# EAGLE design tick-mk-5.0 (EAGLE 6.5.0)
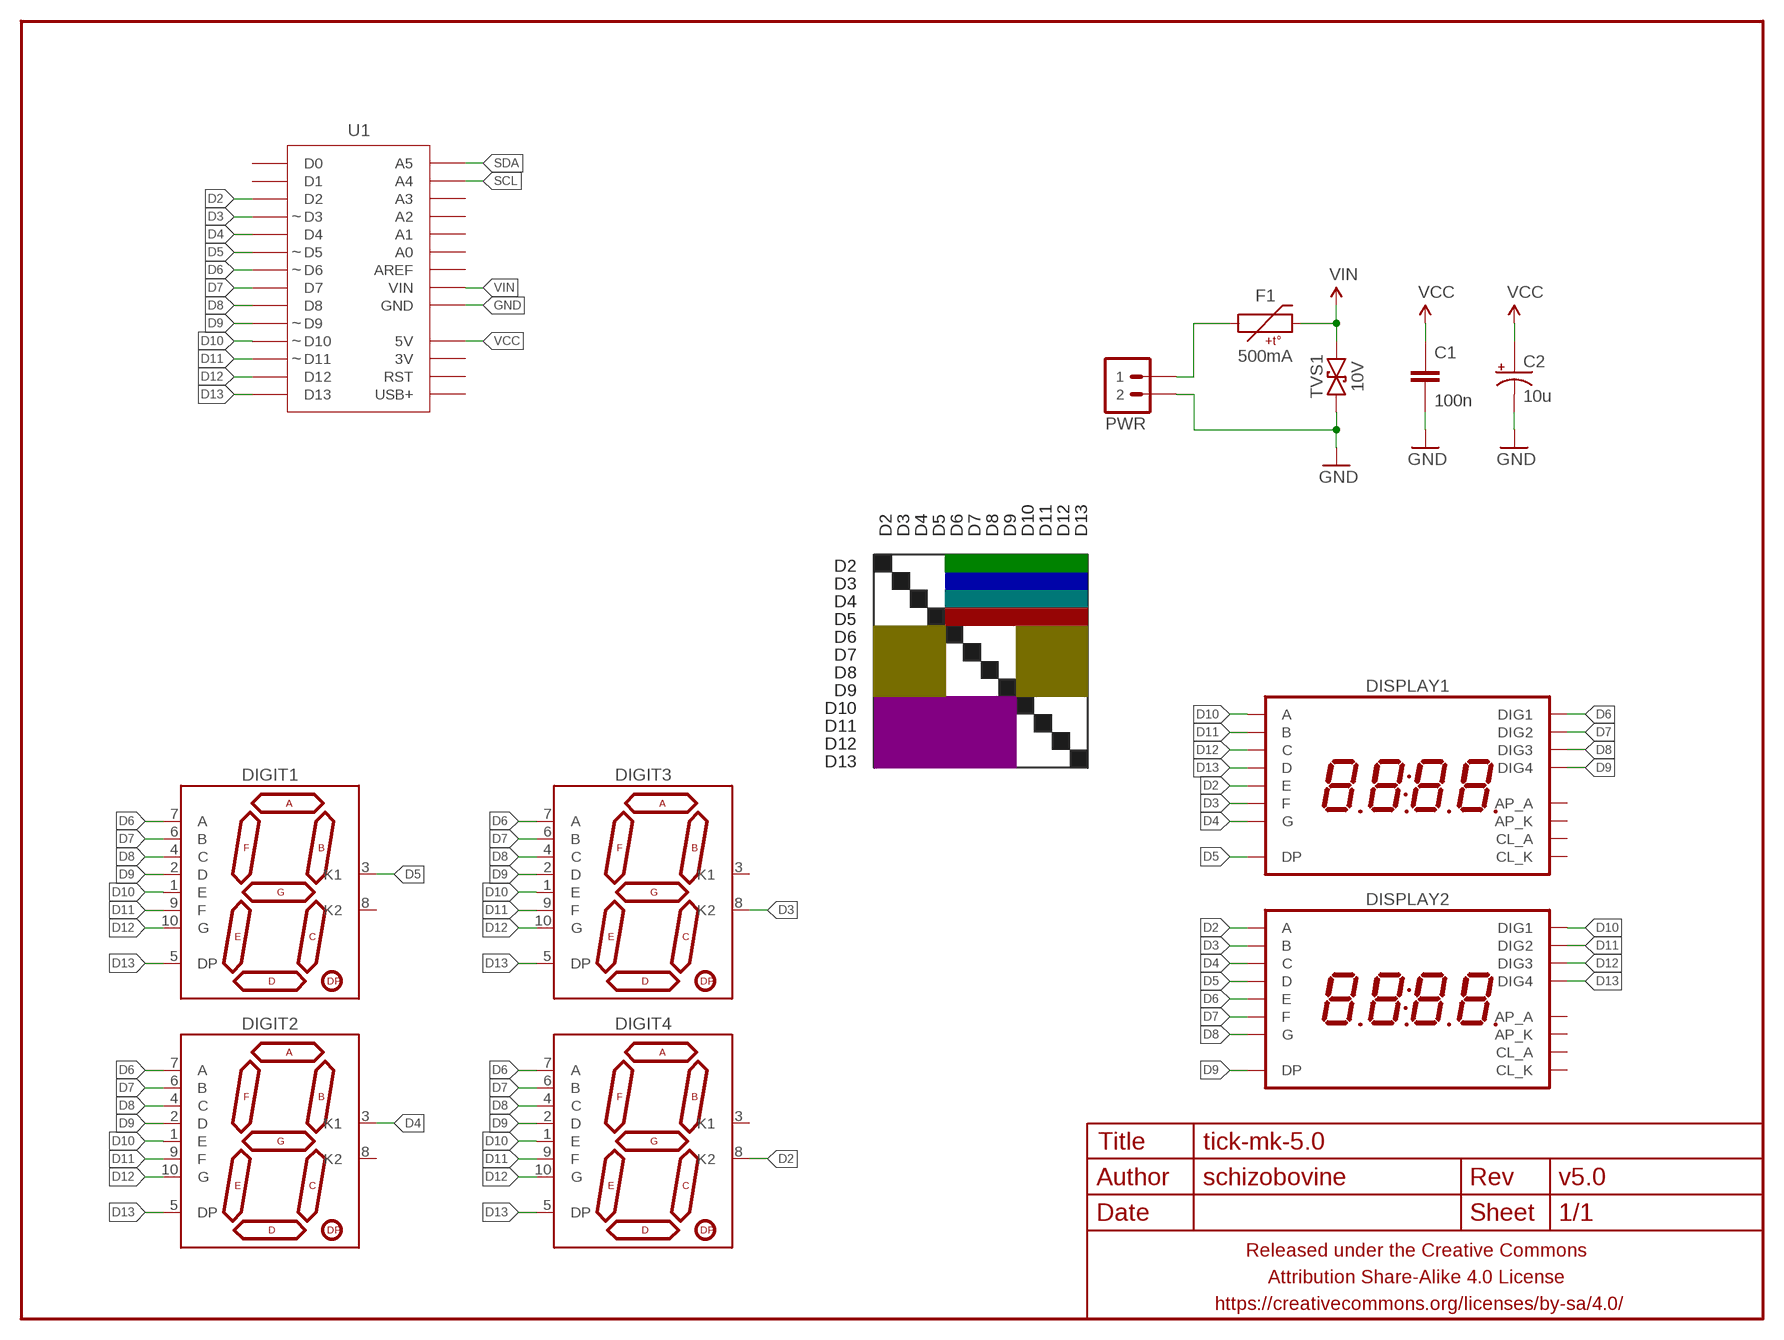
[diagram p0: schematic, sheet 1]

## Parts
C1  100n  CAPACITOR-CERAMIC025-024X044  [C025-024X044]
C2  10u  CAPACITOR-POLARIZEDE2-5  [E2-5]
DIGIT1  7SEG_1DIGPTH-25.4MM-BARE  [7SEG_1DIG_25.4MM_NOSILK]
DIGIT2  7SEG_1DIGPTH-25.4MM-BARE  [7SEG_1DIG_25.4MM_NOSILK]
DIGIT3  7SEG_1DIGPTH-25.4MM-BARE  [7SEG_1DIG_25.4MM_NOSILK]
DIGIT4  7SEG_1DIGPTH-25.4MM-BARE  [7SEG_1DIG_25.4MM_NOSILK]
DISPLAY1  7SEG_4DIGIT_COLON_APOS  [7SEG_4DIG_10MM]
DISPLAY2  7SEG_4DIGIT_COLON_APOS  [7SEG_4DIG_10MM]
F1  500mA  PTCPTH-5.08MM  [PTC-PTH-5.08MM]
FRAME1  FRAME-LETTERNO_PACKAGE  [DUMMY]
PWR  M02JST-PTH-VERT  [JST-2-PH-VERT-PTH]
TVS1  10V  TVSDO-41-10.16MM  [DO-41-TVS-BI-10.16MM]
U1  ADAFRUIT_METRO_MININOHOLES-NOOUTLINE-SILK  [ADAFRUIT_METRO_MINI]

## Nets
D2: DIGIT4.8(K2) DISPLAY1.5(E) DISPLAY2.14(A) U1.3(D2)
D3: DIGIT3.8(K2) DISPLAY1.11(F) DISPLAY2.16(B) U1.4(D3)
D4: DIGIT2.3(K1) DISPLAY1.15(G) DISPLAY2.13(C) U1.5(D4)
D5: DIGIT1.3(K1) DISPLAY1.7(DP) DISPLAY2.3(D) U1.6(D5)
D6: DIGIT1.7(A) DIGIT2.7(A) DIGIT3.7(A) DIGIT4.7(A) DISPLAY1.1(DIG1) DISPLAY2.5(E) U1.7(D6)
D7: DIGIT1.6(B) DIGIT2.6(B) DIGIT3.6(B) DIGIT4.6(B) DISPLAY1.2(DIG2) DISPLAY2.11(F) U1.8(D7)
D8: DIGIT1.4(C) DIGIT2.4(C) DIGIT3.4(C) DIGIT4.4(C) DISPLAY1.6(DIG3) DISPLAY2.15(G) U1.9(D8)
D9: DIGIT1.2(D) DIGIT2.2(D) DIGIT3.2(D) DIGIT4.2(D) DISPLAY1.8(DIG4) DISPLAY2.7(DP) U1.10(D9)
D10: DIGIT1.1(E) DIGIT2.1(E) DIGIT3.1(E) DIGIT4.1(E) DISPLAY1.14(A) DISPLAY2.1(DIG1) U1.11(D10)
D11: DIGIT1.9(F) DIGIT2.9(F) DIGIT3.9(F) DIGIT4.9(F) DISPLAY1.16(B) DISPLAY2.2(DIG2) U1.12(D11)
D12: DIGIT1.10(G) DIGIT2.10(G) DIGIT3.10(G) DIGIT4.10(G) DISPLAY1.13(C) DISPLAY2.6(DIG3) U1.13(D12)
D13: DIGIT1.5(DP) DIGIT2.5(DP) DIGIT3.5(DP) DIGIT4.5(DP) DISPLAY1.3(D) DISPLAY2.8(DIG4) U1.14(D13)
GND: C1.2 C2.- PWR.2 TVS1.P$1 U1.19(GND) U1.20(GND)
N$7: F1.P$1 PWR.1
SCL: U1.27(A4)
SDA: U1.28(A5)
VCC: C1.1 C2.+ U1.18(5V)
VIN: F1.P$2 TVS1.P$2 U1.21(VIN)
Unconnected: DIGIT1.8(K2) DIGIT2.8(K2) DIGIT3.3(K1) DIGIT4.3(K1) DISPLAY1.4(CL_A) DISPLAY1.9(AP_K) DISPLAY1.10(AP_A) DISPLAY1.12(CL_K) DISPLAY2.4(CL_A) DISPLAY2.9(AP_K) DISPLAY2.10(AP_A) DISPLAY2.12(CL_K) U1.1(D0) U1.2(D1) U1.15(USB+) U1.16(RST) U1.17(3V) U1.22(AREF) U1.23(A0) U1.24(A1) U1.25(A2) U1.26(A3)

## Notes on the sheet
- D2 | D3 | D4 | D5 | D6 | D7 | D8 | D9 | D10 | D11 | D12 | D13
- D2
- D3
- D4
- D5
- D6
- D7
- D8
- D9
- D10
- D11
- D12
- D13

## Library data of the parts
C1 = A_butts:CAPACITOR-CERAMIC: CAPACITOR, European symbol
C2 = A_butts:CAPACITOR-POLARIZED: POLARIZED CAPACITOR, American symbol
DIGIT1-DIGIT4 = A_butts:7SEG_1DIG
DISPLAY1 DISPLAY2 = A_butts:7SEG_4DIGIT_COLON_APOS
F1 = A_butts:PTC: Resettable Fuse PTC Resettable Fuse. Spark Fun Electronics SKU : COM-08357
FRAME1 = A_butts:FRAME-LETTER: Schematic Frame Standard 8.5x11 US Letter frame; DESIGNER: schizobovine; VERSION: v5.0
PWR = A_butts:M02: Standard 2-pin 0.1" header. Use with - straight break away headers ( PRT-00116) - right angle break away headers (PRT-00553) - swiss pins (PRT-00743) - machine pins (PRT-00117) - female headers (PRT-00115) Molex polarized connector foot print use with: PRT-08233 with associated crimp pins and housings. 2.54_SCREWTERM for use with PRT-10571. 3.5mm Screw Terminal footprints for PRT-08084 5mm Screw Terminal footprints for use with PRT-08433
TVS1 = A_butts:TVS: Transient voltage suppressor- prevents ESD on inputs. Ignore package description- MBRA140 is NOT this type of part!!!
U1 = A_butts:ADAFRUIT_METRO_MINI

## Board
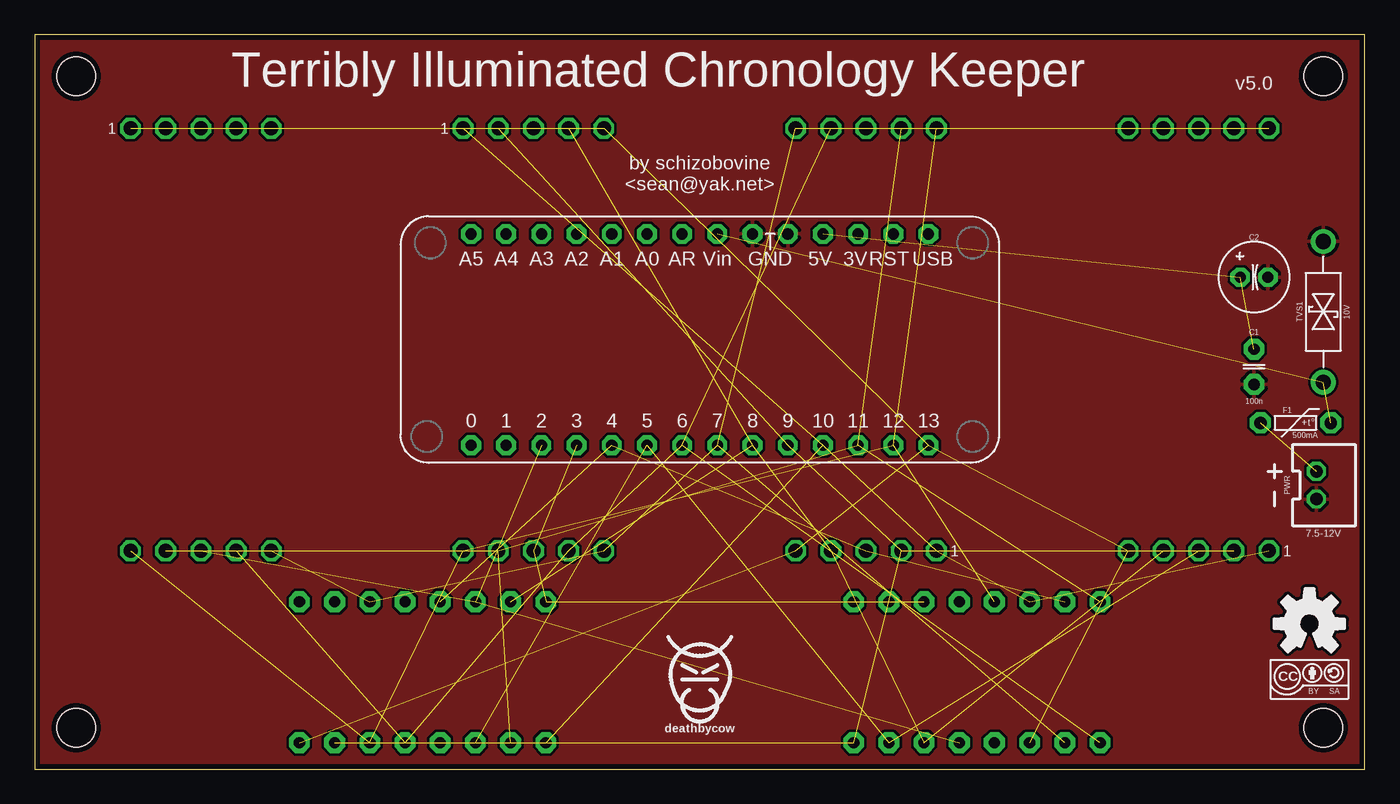
[diagram p1: board, top side]
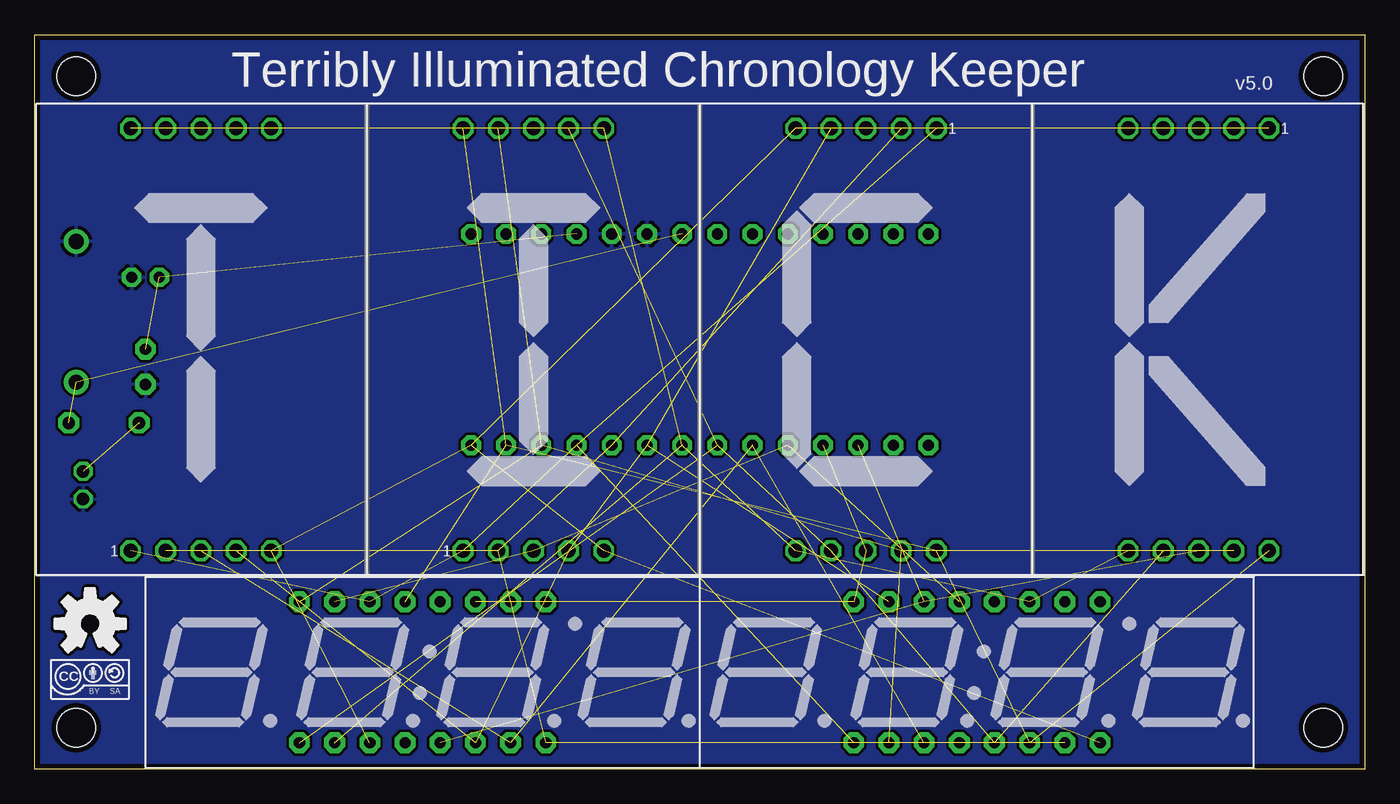
[diagram p2: board, bottom side, seen from below]

Size 96 x 53 mm. Coordinates in mm from the lower left corner, seen from the top.
Outline: 96,0 96,53 0,53 0,0 96,0
Copper layers (1*16): Top 0.0356mm / dielectric 1.5011mm / Bottom 0.0356mm
Design rules "LaenPCBOrder_2": minimum track width 6mil, minimum drill 13mil, track to track 6mil, track to pad 6mil, pad to pad 6mil, via to via 6mil, smd to smd 6mil, copper to edge 15mil, drill to drill 6mil, minimum pad ring 7mil, minimum via ring 7mil, stop-mask expansion 3mil, vias tented up to drill 20mil, thermal gap 10mil
Holes 2.8 mm at 3,3 93,3 93,50 3,50

### Footprints (pad centres in the part's own frame; a part is rotated, then mirrored left to right if it is on the bottom)
C025-024X044 = drill 0.813 pad 1.5 octagon: 1 -1.27,0; 2 1.27,0
E2-5 = drill 0.8 pad 1.4 octagon: + -1,0; - 1,0
7SEG_1DIG_25.4MM_NOSILK = drill 1 pad 1.5 octagon: 1 -5.08,-15.24; 2 -2.54,-15.24; 3 0,-15.24; 4 2.54,-15.24; 5 5.08,-15.24; 6 5.08,15.24; 7 2.54,15.24; 8 0,15.24; 9 -2.54,15.24; 10 -5.08,15.24
7SEG_4DIG_10MM = drill 0.8 pad 1.5 octagon: 1 -8.89,-5.08; 2 -6.35,-5.08; 3 -3.81,-5.08; 4 -1.27,-5.08; 5 1.27,-5.08; 6 3.81,-5.08; 7 6.35,-5.08; 8 8.89,-5.08; 9 8.89,5.08; 10 6.35,5.08; 11 3.81,5.08; 12 1.27,5.08; 13 -1.27,5.08; 14 -3.81,5.08; 15 -6.35,5.08; 16 -8.89,5.08
PTC-PTH-5.08MM = drill 0.9 pad 1.5 octagon: P$1 -2.54,0; P$2 2.54,0
JST-2-PH-VERT-PTH = drill 0.9 octagon: 1 -1,0; 2 1,0
DO-41-TVS-BI-10.16MM = drill 1.1 pad 1.778: P$1 -5.08,0; P$2 5.08,0
ADAFRUIT_METRO_MINI = drill 0.8 pad 1.422 octagon: 1 16.51,7.62; 2 13.97,7.62; 3 11.43,7.62; 4 8.89,7.62; 5 6.35,7.62; 6 3.81,7.62; 7 1.27,7.62; 8 -1.27,7.62; 9 -3.81,7.62; 10 -6.35,7.62; 11 -8.89,7.62; 12 -11.43,7.62; 13 -13.97,7.62; 14 -16.51,7.62; 15 -16.51,-7.62; 16 -13.97,-7.62; 17 -11.43,-7.62; 18 -8.89,-7.62; 19 -6.35,-7.62; 20 -3.81,-7.62; 21 -1.27,-7.62; 22 1.27,-7.62; 23 3.81,-7.62; 24 6.35,-7.62; 25 8.89,-7.62; 26 11.43,-7.62; 27 13.97,-7.62; 28 16.51,-7.62

### Placement (x,y rotation side)
C1  88,29.04 270 top
C2  88,35.5 0 top
DIGIT1  84,31 0 bottom
DIGIT2  60,31 0 bottom
DIGIT3  36,31 180 bottom
DIGIT4  12,31 180 bottom
DISPLAY1  68,7 0 bottom
DISPLAY2  28,7 0 bottom
F1  91,25 0 top
FRAME1  0,-0.5 0 top
PWR  92.5,20.5 270 top
TVS1  93,33 270 top
U1  48,31 180 top
U$1  [TICK_SYMBOL]  48,31 0 bottom
U$2  [COW_SMALL]  48,7 0 top
U$4  [CC-BY-SA-4.0-NO-URL]  92,6.5 0 top
U$5  [OSHWLOGO_TOP_0.2]  92,10.5 0 top
U$6  [OSHWLOGO_TOP_0.2]  92,10.5 0 bottom
U$7  [CC-BY-SA-4.0-NO-URL]  92,6.5 0 bottom

### Tracks (layer width: path | path; a pad name or v marks a point on that pad's centre or on a via)
D2  (3 unrouted)
D3  (3 unrouted)
D4  (3 unrouted)
D5  (3 unrouted)
D6  (6 unrouted)
D7  (6 unrouted)
D8  (6 unrouted)
D9  (6 unrouted)
D10  (6 unrouted)
D11  (6 unrouted)
D12  (6 unrouted)
D13  (6 unrouted)
GND
  pour Top (isolate 0.2): 0,53 96,53 96,0 0,0
  pour Bottom (isolate 0.2): 0,53 96,53 96,0 0,0
N$7  (1 unrouted)
VCC  (2 unrouted)
VIN  (2 unrouted)

### Text on the board
tPlace: Terribly Illuminated Chronology Keeper | by schizobovine / <sean@yak.net> | 7.5-12V
bPlace: Terribly Illuminated Chronology Keeper